# EAGLE design Data_Board_Solo (EAGLE 9.6.0)
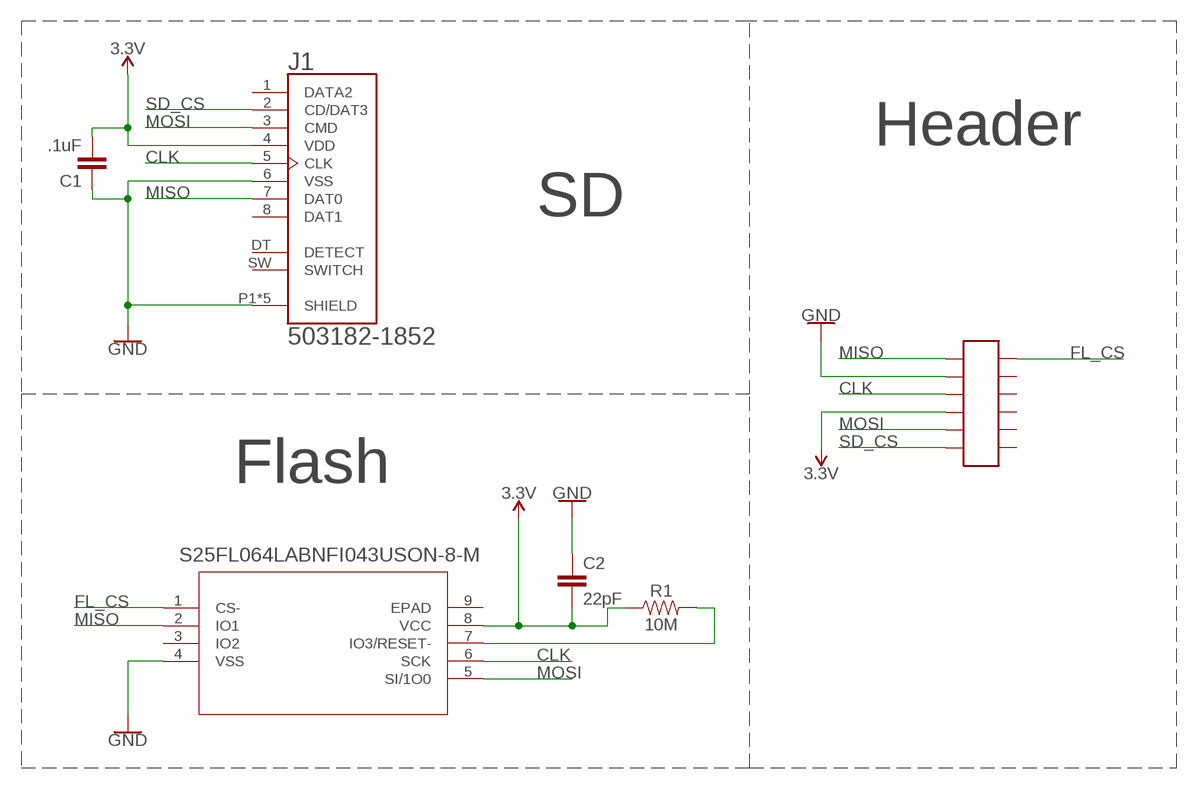
[diagram p0: schematic, sheet 1]

## Parts
C1  .1uF  10NF-0603-50V-10%  [0603]
C2  22pF  10NF-0603-50V-10%  [0603]
J1  503182-1852  [MOLEX_503182-1852]
R1  10M  220KOHM-0603-1/10W-1%  [0603]
U1  S25FL064LABNFI043USON-8-M  [USON-8-M]
U$1  12POS_HEADER  [12POS_HEADER]

## Nets
3.3V: C1.2 C2.2 J1.4(VDD) R1.1 U1.8(VCC) U$1.P$4
CLK: J1.5(CLK) U1.6(SCK) U$1.P$3
FL_CS: U1.1(CS-) U$1.P$12
GND: C1.1 C2.1 J1.6(VSS) J1.P1(SHIELD) J1.P2(SHIELD) J1.P3(SHIELD) J1.P4(SHIELD) J1.P5(SHIELD) U1.4(VSS) U$1.P$2
MISO: J1.7(DAT0) U1.2(IO1) U$1.P$1
MOSI: J1.3(CMD) U1.5(SI/1O0) U$1.P$5
N$6: R1.2 U1.7(IO3/RESET-)
SD_CS: J1.2(CD/DAT3) U$1.P$6
Unconnected: J1.1(DATA2) J1.8(DAT1) J1.DT(DETECT) J1.SW(SWITCH) U1.3(IO2) U1.9(EPAD) U$1.P$7 U$1.P$8 U$1.P$9 U$1.P$10 U$1.P$11

## Notes on the sheet
- Header
- SD
- Flash

## Library data of the parts
C1 C2 = SparkFun-Capacitors:10NF: 0.01uF/10nF/10,000pF ceramic capacitors A capacitor is a passive two-terminal electrical component used to store electrical energy temporarily in an electric field. CAP-09321; PROD_ID: CAP-00867; VALUE: 10nF
J1 = 503182-1852:503182-1852: Conn Micro SD Card M 8 POS 1.09mm Solder RA SMD Embossed T/R 0.5A/Contact; DESCRIPTION: 10 (8 + 2) Position Card Connector microSD™ Surface Mount, Right Angle Gold; DIGI-KEY_PART_NUMBER: WM12834CT-ND; MF: Molex; MP: 5031821852; PACKAGE: None; PURCHASE-URL: https://pricing.snapeda.com/search/part/5031821852/?ref=eda
R1 = SparkFun-Resistors:220KOHM: 220kΩ resistor A resistor is a passive two-terminal electrical component that implements electrical resistance as a circuit element. Resistors act to reduce current flow, and, at the same time, act to lower voltage levels within circuits. - Wikipedia; PROD_ID: RES-08969; VALUE: 220k
U1 = S25FL064LABNFI043-Flash:S25FL064LABNFI043; BUILT_BY: EMA_Jessica; COPYRIGHT: Copyright (C) 2018 Accelerated Designs. All rights reserved; MANUFACTURER_PART_NUMBER: S25FL064LABNFI043; SOURCELIBRARY: Cypress_Semiconductor_2019-12-17; VENDOR: Cypress Semiconductor
U$1 = a4e-axe-connectors:12POS_HEADER

## Board
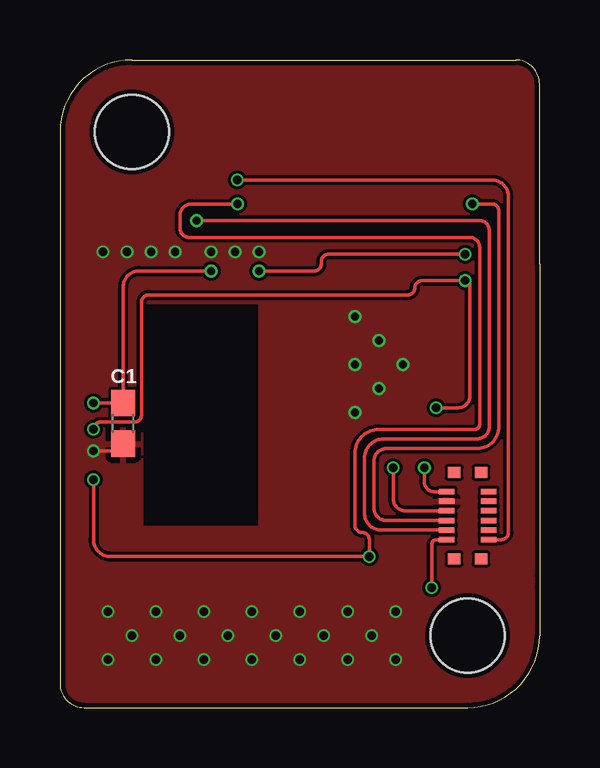
[diagram p1: board, top side]
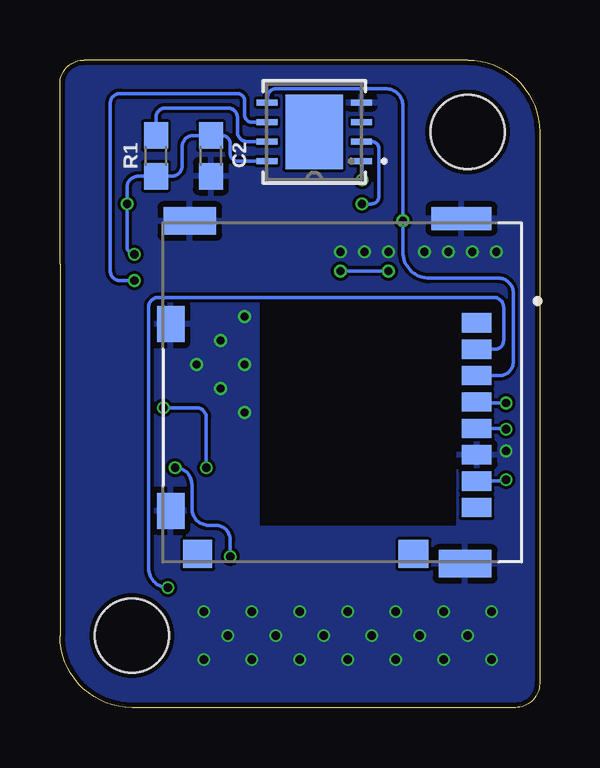
[diagram p2: board, bottom side, seen from below]

Size 20 x 27 mm. Coordinates in mm from the lower left corner, seen from the top.
Outline: 0,24 0,1 arc90 1,0 17,0 arc90 20,3 20,5 20,5.5 20,18.5 20,19 20,26 arc90 19,27 3,27 arc90 0,24
Copper layers (1*16): Top 0.035559375mm / dielectric 1.6mm / Bottom 0.035559375mm
Design rules "jlcpcb2layer *": minimum track width 5mil, minimum drill 12mil, track to track 5mil, track to pad 5mil, pad to pad 5mil, via to via 5mil, smd to smd 5mil, copper to edge 8mil, drill to drill 6mil, minimum pad ring 5mil, minimum via ring 3mil, stop-mask expansion 2.5mil, vias tented up to drill 20mil, thermal gap 10mil
Holes 3.1 mm at 3,24 17,3

### Footprints (pad centres in the part's own frame; a part is rotated, then mirrored left to right if it is on the bottom)
0603 = smd 1.1 x 1: 1 -0.85,0; 2 0.85,0
MOLEX_503182-1852 = smd 0.8 x 1.24: 1 -2.9,6.355; 2 -1.8,6.355; 3 -0.7,6.355; 4 0.4,6.355; 5 1.5,6.355; 6 2.6,6.355; 7 3.7,6.355; 8 4.8,6.355 | smd 1.16 x 1.2: DT 6.74,-5.275 | smd 0.95 x 2.5: P1 -7.245,5.725 | smd 1.15 x 2.2: P2 7.145,5.875; P3 -7.145,-5.605 | smd 1.5 x 1.15: P4 -2.84,-6.4; P5 4.94,-6.4 | smd 1.16 x 1.25: SW 6.74,3.725
USON-8-M = smd 0.864 x 0.254: 1 -1.968,1.219; 2 -1.968,0.406; 3 -1.968,-0.406; 4 -1.968,-1.219; 5 1.968,-1.219; 6 1.968,-0.406; 7 1.968,0.406; 8 1.968,1.219 | smd 2.388 x 3.099: 9 0,0
12POS_HEADER = smd 0.65 x 0.23: P$1 -0.875,1; P$2 -0.875,0.6; P$3 -0.875,0.2; P$4 -0.875,-0.2; P$5 -0.875,-0.6; P$6 -0.875,-1; P$7 0.875,1; P$8 0.875,0.6; P$9 0.875,0.2; P$10 0.875,-0.2; P$11 0.875,-0.6; P$12 0.875,-1 | smd 0.53 x 0.45: P$13 -0.565,-1.8; P$14 0.565,-1.8; P$15 -0.565,1.8; P$16 0.565,1.8

### Placement (x,y rotation side)
C1  2.64,11.85 90 top
C2  13.7,23 90 bottom
J1  8.98,13.14 270 bottom
R1  16,23 90 bottom
U1  9.4,24 180 bottom
U$1  17,8 0 top

### Tracks (layer width: path | path; a pad name or v marks a point on that pad's centre or on a via)
3.3V  (via drill 0.35)
  Top 0.152: v1.39,12.7 C1.2 2.64,17.54 arc-90 3.3,18.2 v6.3,18.2 | U$1.P$4 13.6,7.8 arc-90 13.1,8.3 13.1,10.3 arc-90 13.6,10.8 17.4,10.8 arc90 18.3,11.7 18.3,20.7 arc90 18,21 v17.2,21 | v8.3,18.2 10.6,18.2 arc90 10.9,18.5 10.9,18.6 arc-90 11.2,18.9 v16.89,18.9
  Bottom 0.152: J1.4 2.58,12.7 v1.39,12.7 | U1.8 12.58,22.78 arc90 12.9,23.1 12.9,23.5 arc-90 13.25,23.85 C2.2 14.45,23.85 arc-90 14.9,23.4 14.9,22.6 arc90 15.35,22.15 R1.1 16.75,22.15 arc-90 17.2,21.7 v17.2,21 17.2,19.21 arc-90 v16.89,18.9 | v6.3,18.2 v8.3,18.2
CLK  (via drill 0.35)
  Top 0.152: U$1.P$3 14.4,8.2 arc-90 13.9,8.7 v13.9,10 | v15.69,12.5 16.6,12.5 arc90 17.1,13 17.1,17.59 arc90 v16.89,17.8 15.1,17.8 arc90 14.8,17.5 arc-90 14.5,17.2 3.7,17.2 arc90 3.4,16.9 3.4,12.2 arc-90 3.1,11.9 1.69,11.9 arc90 v1.4,11.61
  Bottom 0.152: U1.6 12.01,24.41 arc90 12.3,24.7 12.3,25.3 arc-90 12.6,25.6 17.5,25.6 arc-90 17.9,25.2 17.9,18.2 arc-90 17.5,17.8 v16.89,17.8 | J1.5 1.43,11.64 arc90 v1.4,11.61 | v13.9,10 13.9,12.1 arc-90 14.3,12.5 v15.69,12.5
FL_CS  (via drill 0.35)
  Top 0.152: U$1.P$12 18.4,7 arc90 18.7,7.3 18.7,21.3 arc90 18,22 v7.4,22
  Bottom 0.152: v7.4,22 7.4,22.75 arc-90 U1.1
GND  (via drill 0.35)
  Top 0.152: C1.1 2.34,10.7 v1.39,10.7
  other vias: 1.8,19 2.8,19 3.8,19 4.8,19 2,2 2,4 3,3 5,3 4,4 4,2 6,2 6,4 7,3 8,4 8,2 9,3 10,4 12,4 11,3 10,2 12,2 13,3 14,4 14,2 12.3,16.3 13.3,15.3 12.3,14.3 14.3,14.3 13.3,13.3 12.3,12.3 6.3,19 7.3,19 8.3,19
  pour Bottom: 21,28 21,0 0,0 0,28
  pour Top: 0,28 21,28 21,0 0,0
MISO  (via drill 0.35)
  Top 0.152: U$1.P$1 15.6,9 arc-90 15.2,9.4 v15.2,10 | v1.4,9.5 1.4,7 arc90 2.1,6.3 v12.9,6.3 12.9,7 arc90 12.6,7.3 arc-90 12.3,7.6 12.3,10.6 arc-90 13.3,11.6 17.3,11.6 arc90 17.5,11.8 17.5,19.2 arc90 17.1,19.6 5.4,19.6 arc-90 5,20 5,20.5 arc-90 5.5,21 v7.41,21
  Bottom 0.152: v1.4,9.5 arc90 1.46,9.44 J1.7 | v12.9,6.3 12.9,7 arc-90 13.5,7.6 13.8,7.6 arc90 14.5,8.3 14.5,9.3 arc-90 v15.2,10 | U1.2 arc90 U1.2 7,23.6 arc90 6.7,23.3 6.7,21.31 arc90 7.01,21 v7.41,21
MOSI  (via drill 0.35)
  Top 0.152: U$1.P$5 13.4,7.4 arc-90 12.7,8.1 12.7,10.4 arc-90 13.5,11.2 17.4,11.2 arc90 17.9,11.7 17.9,19.9 arc90 17.5,20.3 v5.7,20.3
  Bottom 0.152: J1.3 1.66,13.84 arc-90 1.1,14.4 1.1,17.3 arc-90 1.7,17.9 4.6,17.9 arc90 5.7,19 v5.7,20.3 5.7,25.1 arc-90 6.4,25.8 11,25.8 arc-90 11.34,25.46 U1.5
N$6
  Bottom 0.152: U1.7 arc-90 U1.7 12.2,23.6 arc90 12.6,24 12.6,24.6 arc-90 13,25 15.6,25 arc-90 16,24.6 R1.2
SD_CS  (via drill 0.35)
  Top 0.152: U$1.P$6 15.7,7 arc90 15.5,6.8 v15.5,5
  Bottom 0.152: J1.2 1.86,14.94 arc-90 1.5,15.3 1.5,16.7 arc-90 1.9,17.1 15.9,17.1 arc-90 16.3,16.7 16.3,5.8 arc-90 v15.5,5